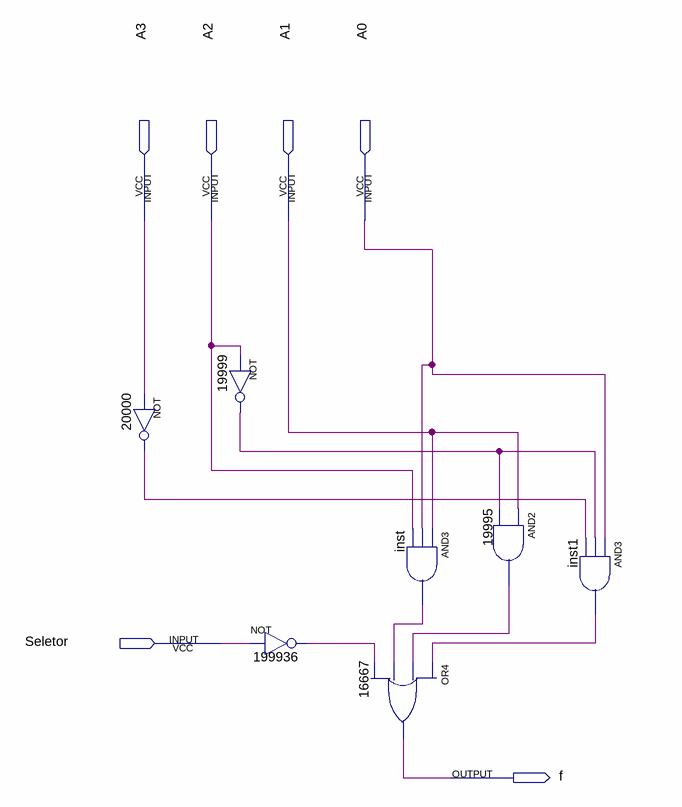
[diagram p0: schematic sheet]
// Quartus schematic segmeto_f.bdf as structural Verilog: 7 symbols, 6 pins
module segmeto_f (
  input  A3,
  input  A2,
  input  A1,
  input  A0,
  input  Seletor,
  output f
);

  wire inst1_out, inst_out, n19995_out, n19999_out, n20000_out, n199936_out;

  not u_20000 (n20000_out, A3);
  not u_19999 (n19999_out, A2);
  not u_199936 (n199936_out, Seletor);
  or u_16667 (f, inst1_out, n19995_out, inst_out, n199936_out);
  and inst (inst_out, A1, A0, A2);
  and u_19995 (n19995_out, A1, n19999_out);
  and inst1 (inst1_out, A0, n19999_out, n20000_out);
endmodule
